# Altium project SAMA7_EVK.PrjPcb (part 2 of 5)

## Sheet 02 - Power Distribution.SchDoc
size B; CompanyName: Microchip Technology Inc.; Organization: Microchip Technology; Address1: 2355 West Chandler Blvd.; Address2: Chandler, AZ  85224; Address4: USA; SheetNumber: 3; SheetTotal: 14; SheetTitle: Power Distribution; Time: Time
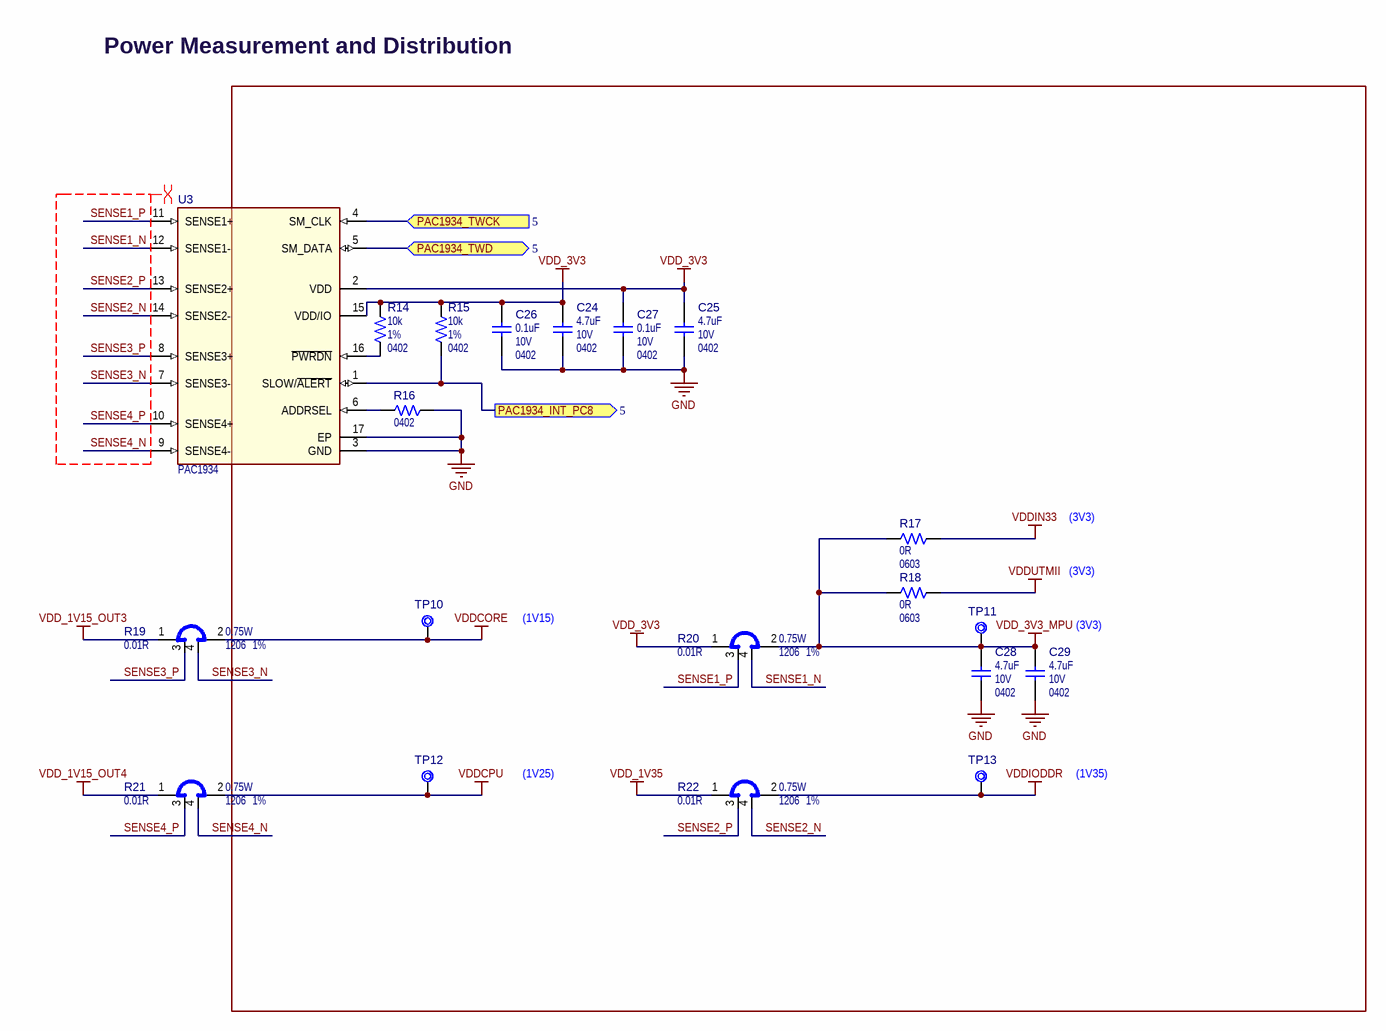
[diagram p2: 02 - Power Distribution.SchDoc]

### Parts
(Parts that share a designator on the sheet are numbered #1, #2 ... from top to bottom, then left to right.)
?#3  (no value)  (graphical)
C24  value 4.7uF  Voltage: 10V  Package: 0402  [CAP_C_0402]  (hidden comment: Capacitor NP)
C25  value 4.7uF  Voltage: 10V  Package: 0402  [CAP_C_0402]  (hidden comment: Capacitor NP)
C26  value 0.1uF  Voltage: 10V  Package: 0402  [CAP_C_0402]  (hidden comment: Capacitor NP)
C27  value 0.1uF  Voltage: 10V  Package: 0402  [CAP_C_0402]  (hidden comment: Capacitor NP)
C28  value 4.7uF  Voltage: 10V  Package: 0402  [CAP_C_0402]  (hidden comment: Capacitor NP)
C29  value 4.7uF  Voltage: 10V  Package: 0402  [CAP_C_0402]  (hidden comment: Capacitor NP)
R14  value 10k  Package: 0402  Tolerance: 1%  [RES_C_0402]  (hidden comment: Resistor)
R15  value 10k  Package: 0402  Tolerance: 1%  [RES_C_0402]  (hidden comment: Resistor)
R16  Package: 0402  [RES_C_0402]  (hidden comment: Resistor)
R17  value 0R  Package: 0603  [RES_C_0603]  (hidden comment: Resistor)
R18  value 0R  Package: 0603  [RES_C_0603]  (hidden comment: Resistor)
R19  value 0.01R  Package: 1206  Tolerance: 1%  Power: 0.75W  [RES_C_1206_SHUNT]  (hidden comment: Shunt 4 Pin)
R20  value 0.01R  Package: 1206  Tolerance: 1%  Power: 0.75W  [RES_C_1206_SHUNT]  (hidden comment: Shunt 4 Pin)
R21  value 0.01R  Package: 1206  Tolerance: 1%  Power: 0.75W  [RES_C_1206_SHUNT]  (hidden comment: Shunt 4 Pin)
R22  value 0.01R  Package: 1206  Tolerance: 1%  Power: 0.75W  [RES_C_1206_SHUNT]  (hidden comment: Shunt 4 Pin)
TP10  Test Point No BOM  [TP_1mm_SMD]  (value not drawn)  (no BOM)
TP11  Test Point No BOM  [TP_1mm_SMD]  (value not drawn)  (no BOM)
TP12  Test Point No BOM  [TP_1mm_SMD]  (value not drawn)  (no BOM)
TP13  Test Point No BOM  [TP_1mm_SMD]  (value not drawn)  (no BOM)
U3  value PAC1934  [UQFN-16_4X4_EP2.6X2.6]  (hidden comment: PAC1934 UQFN-16)

### Ports
PAC1934_INT_PC8 (out, see 5), PAC1934_TWCK (in, see 5), PAC1934_TWD (bidir, see 5)

### Nets
GND: C24.1 C25.1 C26.1 C27.1 C28.1 C29.1 R16.2 U3.3(GND) U3.17(EP)
VDD_1V15_OUT3: R19.1
VDD_1V15_OUT4: R21.1
VDD_1V35: R22.1
VDD_3V3: C24.2 C25.2 C26.2 C27.2 R14.2 R15.2 R20.1 U3.2(VDD) U3.15(VDD/IO)
VDD_3V3_MPU: C28.2 C29.2 R17.1 R18.1 R20.2 TP11.1
VDDCORE: R19.2 TP10.1
VDDCPU: R21.2 TP12.1
VDDIN33: R17.2
VDDIODDR: R22.2 TP13.1
VDDUTMII: R18.2
SENSE1_N: R20.4 U3.12(SENSE1-)
SENSE1_P: R20.3 U3.11(SENSE1+)
SENSE2_N: R22.4 U3.14(SENSE2-)
SENSE2_P: R22.3 U3.13(SENSE2+)
SENSE3_N: R19.4 U3.7(SENSE3-)
SENSE3_P: R19.3 U3.8(SENSE3+)
SENSE4_N: R21.4 U3.9(SENSE4-)
SENSE4_P: R21.3 U3.10(SENSE4+)
NetR14_1: R14.1 U3.16(~{PWRDN})
NetR15_1: R15.1 U3.1(SLOW/~{ALERT}) ; port PAC1934_INT_PC8
NetR16_1: R16.1 U3.6(ADDRSEL)
NetU3_4: U3.4(SM_CLK) ; port PAC1934_TWCK
NetU3_5: U3.5(SM_DATA) ; port PAC1934_TWD

### Layout directives
differential pair: SENSE1_N, SENSE1_P, SENSE2_N, SENSE2_P, SENSE3_N, SENSE3_P, SENSE4_N, SENSE4_P

### Notes on the sheet
- Power Measurement and Distribution
- (3V3)
- (1V15)
- (near C29) (3V3)
- (1V25)
- (1V35)
- Drawn By:
- Engineer:
- PartNumber:
- Project Title
- Sheet Title
- Size
- B
- SCH #:
- PCB #:
- Rev:
- Variant Name
- Date:
- Sheet
- Designed with
- Altium.com <http://go.altium.com/MicrochipLandingPage_Evaluation.html>
- File:

### Library data of the parts
?#3 = Title Block B
C24 C25 C28 C29 = CAP1684: Capacitor; Manufacturer 1: TDK Corporation; Manufacturer Part Number 1: C1005X5R1A475K050BC; Description_: CAP CER 4.7uF 10V 10% X5R SMD 0402; Dev Tools Status: Production; Tolerance: 10%; Temperature Coeffcient: X5R; Type: Ceramic; Owner: Jesus Aviles; Populated: YES; MCHP-ID: CAP1684; Revision: 1; Symbol: Capacitor NP; Status: MCL Design; ComponentLink1Description: SVN Datasheet; ComponentLink2Description: Local Datasheet; ComponentLink3URL: C:\ALTIUM_WORK\00001_MCHP-CDB\Library\LibraryRefs\Capacitor NP.SchLib; ComponentLink3Description: Open Symbol; ComponentLink4URL: C:\ALTIUM_WORK\00001_MCHP-CDB\Library\Footprints\CAP_C_0402.PcbLib; ComponentLink4Description: Open Footprint; ComponentLink5Description: Open Footprint 2; ComponentLink6Description: Open Footprint 3; ComponentLink7Description: Open Footprint 4; Operating Temperature: -55C to 85C; Category: Capacitor; Supplier 1: Digi-Key; Supplier Part Number 1: 445-13820-1-ND; Quantity Override: 1
C26 C27 = CAP1238: Capacitor; Manufacturer 1: KEMET; Manufacturer Part Number 1: C0402C104K8RACTU; Description_: CAP CER 0.1uF 10V 10% X7R SMD 0402; Dev Tools Status: Production; Tolerance: 10%; Temperature Coeffcient: X7R; Type: Ceramic; Owner: Tad Ahlvers; Populated: YES; MCHP-ID: CAP1238; Revision: 1; Symbol: Capacitor NP; Status: MCL Design; ComponentLink1URL: https://chn-vm-apps.microchip.com/mchprepo/parts/Datasheets/KEM_C1002_X7R_SMD.pdf; ComponentLink1Description: SVN Datasheet; ComponentLink2URL: C:\ALTIUM_WORK\00001_MCHP-CDB\Datasheets\KEM_C1002_X7R_SMD.pdf; ComponentLink2Description: Local Datasheet; ComponentLink3URL: C:\ALTIUM_WORK\00001_MCHP-CDB\Library\LibraryRefs\Capacitor NP.SchLib; ComponentLink3Description: Open Symbol; ComponentLink4URL: C:\ALTIUM_WORK\00001_MCHP-CDB\Library\Footprints\CAP_C_0402.PcbLib; ComponentLink4Description: Open Footprint; ComponentLink5Description: Open Footprint 2; ComponentLink6Description: Open Footprint 3; ComponentLink7Description: Open Footprint 4; Operating Temperature: -55C to +125C; Category: Capacitor; Manufacturer 2: Samsung; Manufacturer Part Number 2: CL05B104KP5NNNC; Manufacturer 3: Murata Electronics; Manufacturer Part Number 3: GRM155R71A104KA01D; Supplier 1: Digi-Key; Supplier Part Number 1: 399-3520-2-ND; Supplier 2: Digi-Key; Supplier Part Number 2: 1276-1002-2-ND; Supplier 3: Mouser; Supplier Part Number 3: 81-GRM155R71A104KA1D; Quantity Override: 1
R14 R15 = RSMT1019: Manufacturer 1: Panasonic; Manufacturer Part Number 1: ERJ-2RKF1002X; Description_: RES TKF 10k 1% 1/10W SMD 0402; Dev Tools Status: Production; Voltage: 50V; Temperature Coeffcient: 100ppm/C; Power: 1/10W; Owner: Brent Lanphear; Populated: Yes; MCHP-ID: RSMT1019; Revision: 2; Symbol: Resistor; Status: MCL Design; ComponentLink1URL: https://chn-vm-apps.microchip.com/mchprepo/parts/Datasheets/AOA0000CE2.pdf; ComponentLink1Description: SVN Datasheet; ComponentLink2URL: C:\ALTIUM_WORK\00001_MCHP-CDB\Datasheets\AOA0000CE2.pdf; ComponentLink2Description: Local Datasheet; ComponentLink3URL: C:\ALTIUM_WORK\00001_MCHP-CDB\Library\LibraryRefs\Resistor.SchLib; ComponentLink3Description: Open Symbol; ComponentLink4URL: C:\ALTIUM_WORK\00001_MCHP-CDB\Library\Footprints\RES_C_0402.PcbLib; ComponentLink4Description: Open Footprint; ComponentLink5Description: Open Footprint 2; ComponentLink6Description: Open Footprint 3; ComponentLink7Description: Open Footprint 4; Operating Temperature: -55C to +155C; Category: Resistor; Type: RES SMD; Composition: TKF; Supplier 1: Digi-Key; Supplier Part Number 1: P10.0KLCT-ND; Quantity Override: 1
R16 = RES2693: Manufacturer 1: Bourns Inc.; Manufacturer Part Number 1: CR0402-J/-000GLF; Description_: RES TKF 0R 1/16W SMD 0402; Dev Tools Status: Design; Power: 1/16W; Populated: YES; Owner: Dragos Danaila; Voltage: 50V; Temperature Coeffcient: 100ppm/C; Current: 1A; MCHP-ID: RES2693; Revision: 1; Symbol: Resistor; Status: MCL Design; ComponentLink1URL: https://chn-vm-apps.microchip.com/mchprepo/parts/Datasheets/crxxxxx.pdf; ComponentLink1Description: SVN Datasheet; ComponentLink2URL: C:\ALTIUM_WORK\00001_MCHP-CDB\Datasheets\crxxxxx.pdf; ComponentLink2Description: Local Datasheet; ComponentLink3URL: C:\ALTIUM_WORK\00001_MCHP-CDB\Library\LibraryRefs\Resistor.SchLib; ComponentLink3Description: Open Symbol; ComponentLink4URL: C:\ALTIUM_WORK\00001_MCHP-CDB\Library\Footprints\RES_C_0402.PcbLib; ComponentLink4Description: Open Footprint; ComponentLink5Description: Open Footprint 2; ComponentLink6Description: Open Footprint 3; ComponentLink7Description: Open Footprint 4; Operating Temperature: -55C to +155C; Category: Resistor; Type: RES SMD; Composition: TKF; Supplier 1: Digikey; Supplier Part Number 1: CR0402-J/-000GLFTR-ND; Quantity Override: 1
R17 R18 = RSMT0001: Manufacturer 1: Panasonic; Manufacturer Part Number 1: ERJ-3GSY0R00V; Description_: RES TKF 0R 1/10W SMD 0603; Dev Tools Status: Production; Power: 1/10W; Populated: YES; MCHP-ID: RSMT0001; Revision: 2; Symbol: Resistor; Status: MCL Design; ComponentLink1URL: https://chn-vm-apps.microchip.com/mchprepo/parts/Datasheets/nrc.pdf; ComponentLink1Description: SVN Datasheet; ComponentLink2URL: C:\ALTIUM_WORK\00001_MCHP-CDB\Datasheets\nrc.pdf; ComponentLink2Description: Local Datasheet; ComponentLink3URL: C:\ALTIUM_WORK\00001_MCHP-CDB\Library\LibraryRefs\Resistor.SchLib; ComponentLink3Description: Open Symbol; ComponentLink4URL: C:\ALTIUM_WORK\00001_MCHP-CDB\Library\Footprints\RES_C_0603.PcbLib; ComponentLink4Description: Open Footprint; ComponentLink5Description: Open Footprint 2; ComponentLink6Description: Open Footprint 3; ComponentLink7Description: Open Footprint 4; Operating Temperature: -55C to +155C; Category: Resistor; Type: RES SMD; Composition: TKF; Manufacturer 2: Panasonic; Manufacturer Part Number 2: ERJ-3GEY0R00V; Manufacturer 3: ROHM; Manufacturer Part Number 3: MCR03EZPJ000; Manufacturer 4: Stackpole Electronics Inc; Manufacturer Part Number 4: RMCF0603ZT0R00; Manufacturer 5: Stackpole Electronics Inc; Manufacturer Part Number 5: RMCF 1/16 0 R; Manufacturer 6: Vishay; Manufacturer Part Number 6: CRCW06030000Z0EA; Manufacturer 7: Yageo; Manufacturer Part Number 7: RC0603JR-070RL; Manufacturer 8: KOA Speer; Manufacturer Part Number 8: RK73Z1JTTP; Manufacturer 9: NIC Components; Manufacturer Part Number 9: NRC06Z0TRF; Supplier 1: Digi-Key; Supplier Part Number 1: P0.0GTR-ND; Supplier 2: Digi-Key; Supplier Part Number 2: RHM0.0GCT-ND; Supplier 3: Digi-Key; Supplier Part Number 3: RMCF0603ZT0R00TR-ND; Supplier 4: Digi-Key; Supplier Part Number 4: RMCF0603ZT0R00CT-ND; Supplier 5: Digi-Key; Supplier Part Number 5: RMCF1/160RTR-ND; Supplier 6: Digi-Key; Supplier Part Number 6: 541-0.0GCT-ND; Supplier 7: Digi-Key; Supplier Part Number 7: 311-0.0GRCT-ND; Supplier 8: KOA Speer; Supplier Part Number 8: RK73Z1JTTP; Supplier 9: NIC Components; Supplier Part Number 9: NRC06Z0TRF; Quantity Override: 1
R19-R22 = RSMT1316: Shunt; Manufacturer 1: SUSUMU; Manufacturer Part Number 1: KRL1632E-M-R010-F-T5; Description_: RES SHUNT MF 0.01R 1% 0.75W SMD 1206; Dev Tools Status: Design; Temperature Coeffcient: 50ppm/C; Current: 8A; Owner: Ciprian Abramov; Populated: YES; MCHP-ID: RSMT1316; Revision: 1; Symbol: Shunt 4 Pin; Status: MCL Design; ComponentLink1URL: https://chn-vm-apps.microchip.com/mchprepo/parts/Datasheets/n_catalog_partition09_en.pdf; ComponentLink1Description: SVN Datasheet; ComponentLink2URL: C:\ALTIUM_WORK\00001_MCHP-CDB\Datasheets\n_catalog_partition09_en.pdf; ComponentLink2Description: Local Datasheet; ComponentLink3URL: C:\ALTIUM_WORK\00001_MCHP-CDB\Library\LibraryRefs\Shunt 4 Pin.SchLib; ComponentLink3Description: Open Symbol; ComponentLink4URL: C:\ALTIUM_WORK\00001_MCHP-CDB\Library\Footprints\RES_C_1206_SHUNT.PcbLib; ComponentLink4Description: Open Footprint; ComponentLink5Description: Open Footprint 2; ComponentLink6Description: Open Footprint 3; ComponentLink7Description: Open Footprint 4; Operating Temperature: -55C to +155C; Category: Resistor; Type: RES SMD; Composition: MF; Supplier 1: Digi-Key; Supplier Part Number 1: 408-1570-1-ND; Quantity Override: 1
TP10-TP13 = CON1759: Test Point; Value: TP PAD PCB 1mm; Description_: CON TP PAD PCB 1mm SMD; Dev Tools Status: Design; Owner: Cristian Papuc; Populated: YES; MCHP-ID: CON1759; Revision: A; Symbol: Test Point No BOM; Status: MCL Design; ComponentLink1Description: SVN Datasheet; ComponentLink2Description: Local Datasheet; ComponentLink3URL: C:\ALTIUM_WORK\00001_MCHP-CDB\Library\LibraryRefs\Test Point No BOM.SchLib; ComponentLink3Description: Open Symbol; ComponentLink4URL: C:\ALTIUM_WORK\00001_MCHP-CDB\Library\Footprints\TP_1mm_SMD.PcbLib; ComponentLink4Description: Open Footprint; ComponentLink5Description: Open Footprint 2; ComponentLink6Description: Open Footprint 3; ComponentLink7Description: Open Footprint 4; Type: Test Point; Category: Connector; Quantity Override: 1
U3 = MIC8883: Manufacturer 1: Microchip Technology; Manufacturer Part Number 1: PAC1934T-I/JQ; Description_: MCHP ANALOG POWER CURRENT SENSE MONITOR PAC1934T-I/JQ UQFN-16; Dev Tools Status: Design; Owner: Ciprian Abramov; Populated: YES; MCHP-ID: MIC8883; Symbol: PAC1934 UQFN-16; Type: Power/Current Sensor; Status: MCL Design; Revision: 1; Category: MCHP-Analog; ComponentLink1Description: SVN Datasheet; ComponentLink2Description: Local Datasheet; ComponentLink3URL: C:\ALTIUM_WORK\00001_MCHP-CDB\Library\LibraryRefs\PAC1934 UQFN-16.SchLib; ComponentLink3Description: Open Symbol; ComponentLink4URL: C:\ALTIUM_WORK\00001_MCHP-CDB\Library\Footprints\UQFN-16_4X4_EP2.6X2.6.PcbLib; ComponentLink4Description: Open Footprint; ComponentLink5Description: Open Footprint 2; ComponentLink6Description: Open Footprint 3; ComponentLink7Description: Open Footprint 4; Supplier 1: Digi-Key; Supplier Part Number 1: PAC1934T-I/JQCT-ND; Quantity Override: 1

## Sheet 03 - SAMA7G54-MPU.SchDoc
size B; CompanyName: Microchip Technology Inc.; Organization: Microchip Technology; Address1: 2355 West Chandler Blvd.; Address2: Chandler, AZ  85224; Address4: USA; SheetNumber: 4; SheetTotal: 15; SheetTitle: SAMA7G5-MPU; Time: Time
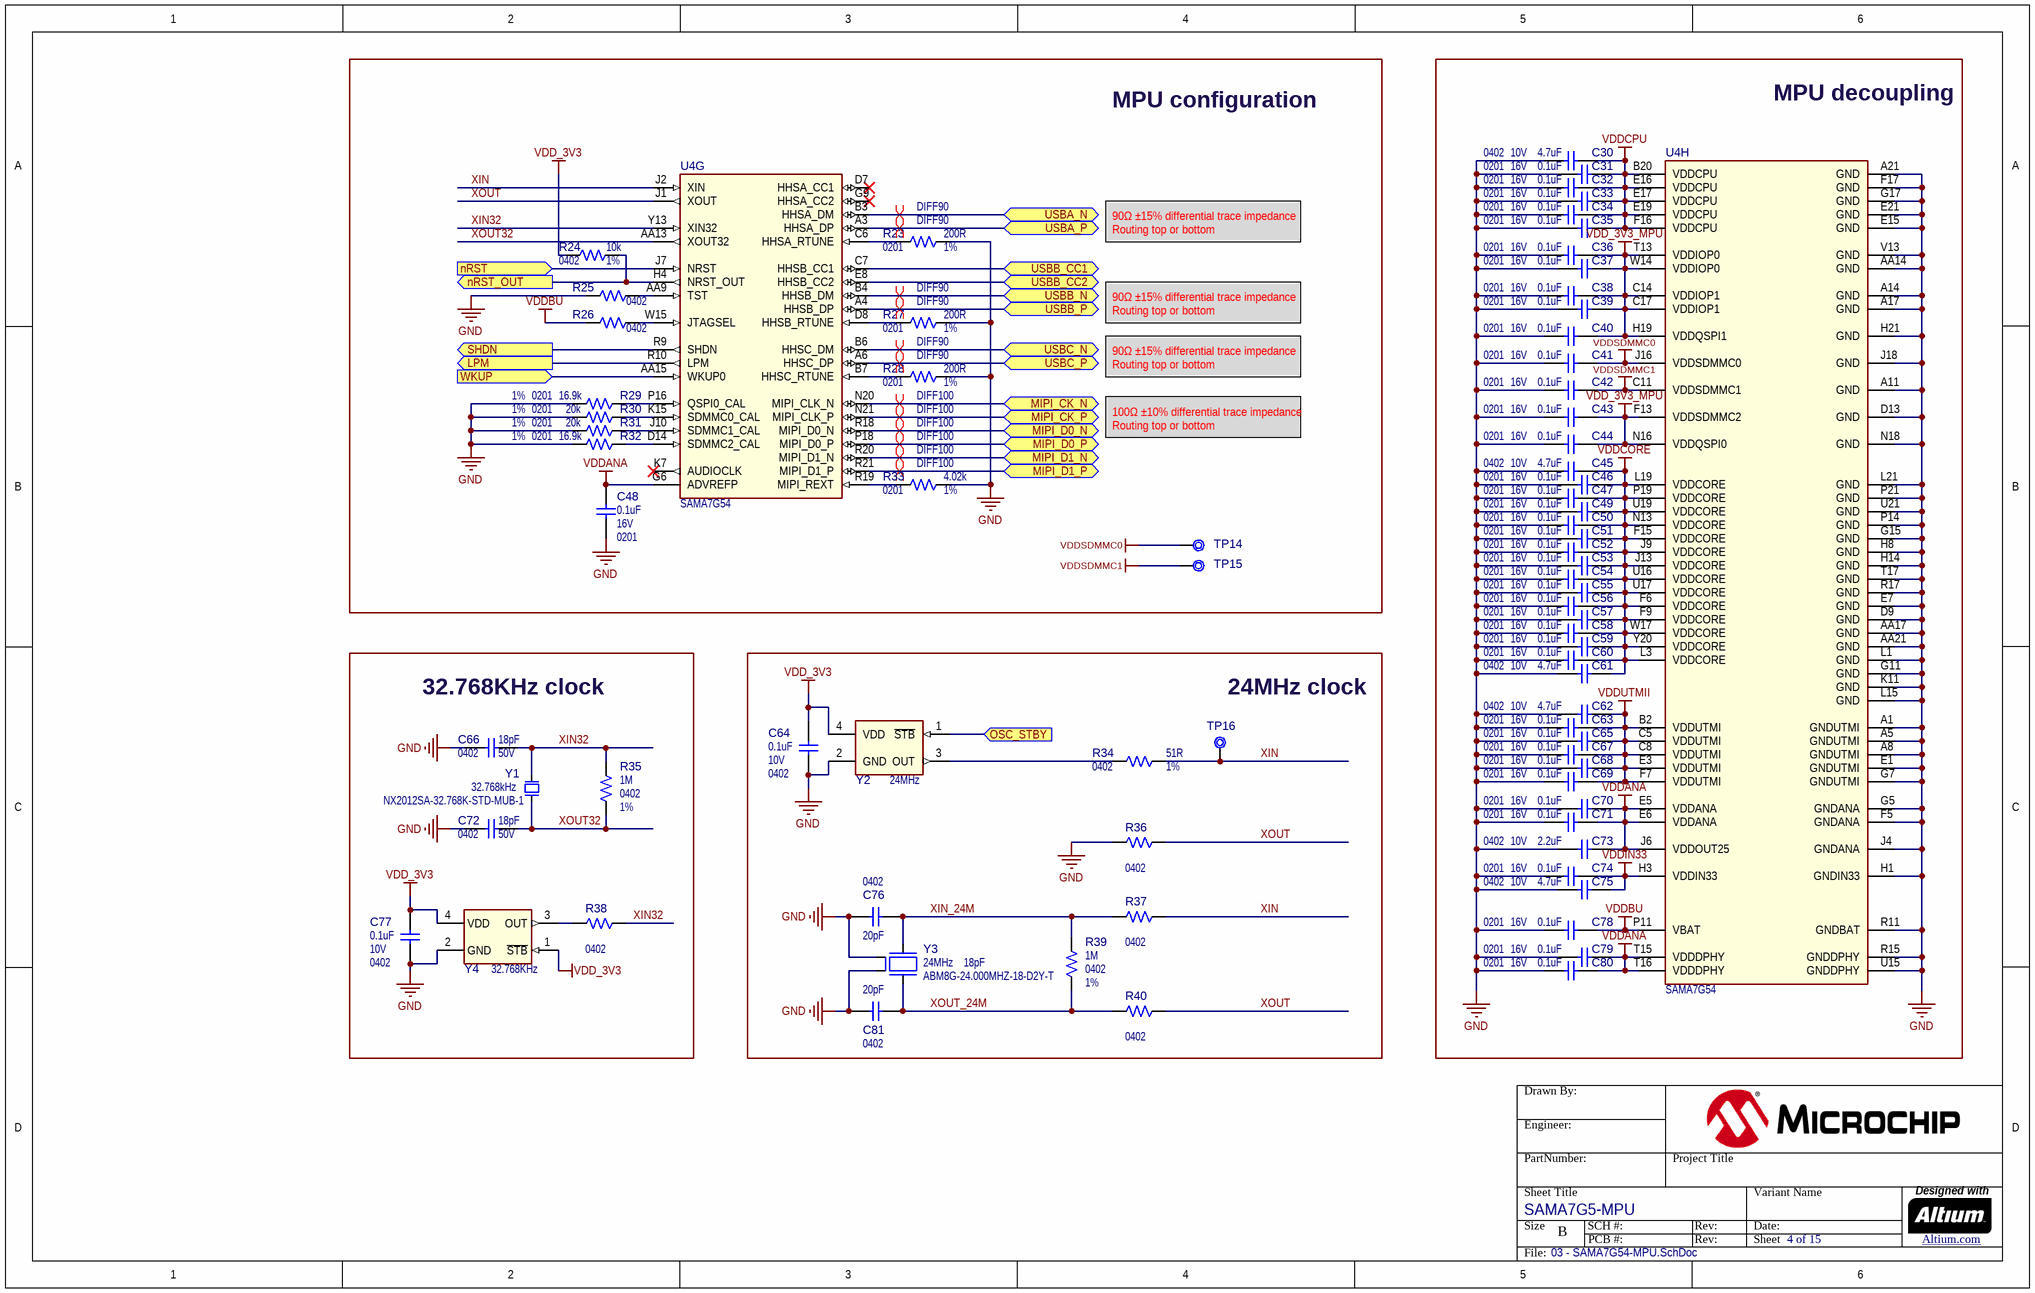
[diagram p3: 03 - SAMA7G54-MPU.SchDoc]

### Parts
(Parts that share a designator on the sheet are numbered #1, #2 ... from top to bottom, then left to right.)
?#4  (no value)  (graphical)
C30  value 4.7uF  Voltage: 10V  Package: 0402  [CAP_C_0402]  (hidden comment: Capacitor NP)
C31  value 0.1uF  Voltage: 16V  Package: 0201  [CAP_C_0201]  (hidden comment: Capacitor NP)
C32  value 0.1uF  Voltage: 16V  Package: 0201  [CAP_C_0201]  (hidden comment: Capacitor NP)
C33  value 0.1uF  Voltage: 16V  Package: 0201  [CAP_C_0201]  (hidden comment: Capacitor NP)
C34  value 0.1uF  Voltage: 16V  Package: 0201  [CAP_C_0201]  (hidden comment: Capacitor NP)
C35  value 0.1uF  Voltage: 16V  Package: 0201  [CAP_C_0201]  (hidden comment: Capacitor NP)
C36  value 0.1uF  Voltage: 16V  Package: 0201  [CAP_C_0201]  (hidden comment: Capacitor NP)
C37  value 0.1uF  Voltage: 16V  Package: 0201  [CAP_C_0201]  (hidden comment: Capacitor NP)
C38  value 0.1uF  Voltage: 16V  Package: 0201  [CAP_C_0201]  (hidden comment: Capacitor NP)
C39  value 0.1uF  Voltage: 16V  Package: 0201  [CAP_C_0201]  (hidden comment: Capacitor NP)
C40  value 0.1uF  Voltage: 16V  Package: 0201  [CAP_C_0201]  (hidden comment: Capacitor NP)
C41  value 0.1uF  Voltage: 16V  Package: 0201  [CAP_C_0201]  (hidden comment: Capacitor NP)
C42  value 0.1uF  Voltage: 16V  Package: 0201  [CAP_C_0201]  (hidden comment: Capacitor NP)
C43  value 0.1uF  Voltage: 16V  Package: 0201  [CAP_C_0201]  (hidden comment: Capacitor NP)
C44  value 0.1uF  Voltage: 16V  Package: 0201  [CAP_C_0201]  (hidden comment: Capacitor NP)
C45  value 4.7uF  Voltage: 10V  Package: 0402  [CAP_C_0402]  (hidden comment: Capacitor NP)
C46  value 0.1uF  Voltage: 16V  Package: 0201  [CAP_C_0201]  (hidden comment: Capacitor NP)
C47  value 0.1uF  Voltage: 16V  Package: 0201  [CAP_C_0201]  (hidden comment: Capacitor NP)
C48  value 0.1uF  Voltage: 16V  Package: 0201  [CAP_C_0201]  (hidden comment: Capacitor NP)
C49  value 0.1uF  Voltage: 16V  Package: 0201  [CAP_C_0201]  (hidden comment: Capacitor NP)
C50  value 0.1uF  Voltage: 16V  Package: 0201  [CAP_C_0201]  (hidden comment: Capacitor NP)
C51  value 0.1uF  Voltage: 16V  Package: 0201  [CAP_C_0201]  (hidden comment: Capacitor NP)
C52  value 0.1uF  Voltage: 16V  Package: 0201  [CAP_C_0201]  (hidden comment: Capacitor NP)
C53  value 0.1uF  Voltage: 16V  Package: 0201  [CAP_C_0201]  (hidden comment: Capacitor NP)
C54  value 0.1uF  Voltage: 16V  Package: 0201  [CAP_C_0201]  (hidden comment: Capacitor NP)
C55  value 0.1uF  Voltage: 16V  Package: 0201  [CAP_C_0201]  (hidden comment: Capacitor NP)
C56  value 0.1uF  Voltage: 16V  Package: 0201  [CAP_C_0201]  (hidden comment: Capacitor NP)
C57  value 0.1uF  Voltage: 16V  Package: 0201  [CAP_C_0201]  (hidden comment: Capacitor NP)
C58  value 0.1uF  Voltage: 16V  Package: 0201  [CAP_C_0201]  (hidden comment: Capacitor NP)
C59  value 0.1uF  Voltage: 16V  Package: 0201  [CAP_C_0201]  (hidden comment: Capacitor NP)
C60  value 0.1uF  Voltage: 16V  Package: 0201  [CAP_C_0201]  (hidden comment: Capacitor NP)
C61  value 4.7uF  Voltage: 10V  Package: 0402  [CAP_C_0402]  (hidden comment: Capacitor NP)
C62  value 4.7uF  Voltage: 10V  Package: 0402  [CAP_C_0402]  (hidden comment: Capacitor NP)
C63  value 0.1uF  Voltage: 16V  Package: 0201  [CAP_C_0201]  (hidden comment: Capacitor NP)
C64  value 0.1uF  Voltage: 10V  Package: 0402  [CAP_C_0402]  (hidden comment: Capacitor NP)
C65  value 0.1uF  Voltage: 16V  Package: 0201  [CAP_C_0201]  (hidden comment: Capacitor NP)
C66  value 18pF  Voltage: 50V  Package: 0402  [CAP_C_0402]  (hidden comment: Capacitor NP)
C67  value 0.1uF  Voltage: 16V  Package: 0201  [CAP_C_0201]  (hidden comment: Capacitor NP)
C68  value 0.1uF  Voltage: 16V  Package: 0201  [CAP_C_0201]  (hidden comment: Capacitor NP)
C69  value 0.1uF  Voltage: 16V  Package: 0201  [CAP_C_0201]  (hidden comment: Capacitor NP)
C70  value 0.1uF  Voltage: 16V  Package: 0201  [CAP_C_0201]  (hidden comment: Capacitor NP)
C71  value 0.1uF  Voltage: 16V  Package: 0201  [CAP_C_0201]  (hidden comment: Capacitor NP)
C72  value 18pF  Voltage: 50V  Package: 0402  [CAP_C_0402]  (hidden comment: Capacitor NP)
C73  value 2.2uF  Voltage: 10V  Package: 0402  [CAP_C_0402]  (hidden comment: Capacitor NP)
C74  value 0.1uF  Voltage: 16V  Package: 0201  [CAP_C_0201]  (hidden comment: Capacitor NP)
C75  value 4.7uF  Voltage: 10V  Package: 0402  [CAP_C_0402]  (hidden comment: Capacitor NP)
C76  value 20pF  Package: 0402  [CAP_C_0402]  (hidden comment: Capacitor NP)
C77  value 0.1uF  Voltage: 10V  Package: 0402  [CAP_C_0402]  (hidden comment: Capacitor NP)
C78  value 0.1uF  Voltage: 16V  Package: 0201  [CAP_C_0201]  (hidden comment: Capacitor NP)
C79  value 0.1uF  Voltage: 16V  Package: 0201  [CAP_C_0201]  (hidden comment: Capacitor NP)
C80  value 0.1uF  Voltage: 16V  Package: 0201  [CAP_C_0201]  (hidden comment: Capacitor NP)
C81  value 20pF  Package: 0402  [CAP_C_0402]  (hidden comment: Capacitor NP)
R23  value 200R  Package: 0201  Tolerance: 1%  [RES_C_0201]  (hidden comment: Resistor)
R24  value 10k  Package: 0402  Tolerance: 1%  [RES_C_0402]  (hidden comment: Resistor)
R25  Package: 0402  [RES_C_0402]  (hidden comment: Resistor)
R26  Package: 0402  [RES_C_0402]  (hidden comment: Resistor)
R27  value 200R  Package: 0201  Tolerance: 1%  [RES_C_0201]  (hidden comment: Resistor)
R28  value 200R  Package: 0201  Tolerance: 1%  [RES_C_0201]  (hidden comment: Resistor)
R29  value 16.9k  Package: 0201  Tolerance: 1%  [RES_C_0201]  (hidden comment: Resistor)
R30  value 20k  Package: 0201  Tolerance: 1%  [RES_C_0201]  (hidden comment: Resistor)
R31  value 20k  Package: 0201  Tolerance: 1%  [RES_C_0201]  (hidden comment: Resistor)
R32  value 16.9k  Package: 0201  Tolerance: 1%  [RES_C_0201]  (hidden comment: Resistor)
R33  value 4.02k  Package: 0201  Tolerance: 1%  [RES_C_0201]  (hidden comment: Resistor)
R34  value 51R  Package: 0402  Tolerance: 1%  [RES_C_0402]  (hidden comment: Resistor)
R35  value 1M  Package: 0402  Tolerance: 1%  [RES_C_0402]  (hidden comment: Resistor)
R36  Package: 0402  [RES_C_0402]  (hidden comment: Resistor)
R37  Package: 0402  [RES_C_0402]  (hidden comment: Resistor)
R38  Package: 0402  [RES_C_0402]  (hidden comment: Resistor)
R39  value 1M  Package: 0402  Tolerance: 1%  [RES_C_0402]  (hidden comment: Resistor)
R40  Package: 0402  [RES_C_0402]  (hidden comment: Resistor)
TP14  Test Point No BOM  [TP_1mm_SMD]  (value not drawn)  (no BOM)
TP15  Test Point No BOM  [TP_1mm_SMD]  (value not drawn)  (no BOM)
TP16  Test Point No BOM  [TP_1mm_SMD]  (value not drawn)  (no BOM)
U4  SAMA7G54  [TFBGA-343_14x14]  (parts G,H of 8)
Y1  value 32.768kHz  Manufacturer Part Number 1: NX2012SA-32.768K-STD-MUB-1  [CRYSTAL_NX2012SA]  (hidden comment: Crystal 2 Pins)
Y2  value 24MHz  [DFN-4_2.5x2]  (hidden comment: DSC10xx DFN-4)
Y3  value 24MHz  Load Capacitance: 18pF  Manufacturer Part Number 1: ABM8G-24.000MHZ-18-D2Y-T  [CRYSTAL_ABM8G]  (hidden comment: Crystal 4 Pins)
Y4  value 32.768KHz  [DFN-4_2x1.6]  (hidden comment: DSC60xx DFN-4_LGA-4)

### Blocks framed on the sheet
MPU configuration: C48 R23-R33 TP14 TP15 U4
MPU decoupling: C30-C47 C49-C63 C65 C67-C71 C73-C75 C78-C80 U4
32.768KHz clock: C66 C72 C77 R35 R38 Y1 Y4
24MHz clock: C64 C76 C81 R34 R36 R37 R39 R40 TP16 Y2 Y3

### Ports
LPM (out), MIPI_CK_N (bidir), MIPI_CK_P (bidir), MIPI_D0_N (bidir), MIPI_D0_P (bidir), MIPI_D1_N (bidir), MIPI_D1_P (bidir), nRST (in), nRST_OUT (out), OSC_STBY (in), SHDN (out), USBA_N (bidir), USBA_P (bidir), USBB_CC1 (bidir), USBB_CC2 (bidir), USBB_N (bidir), USBB_P (bidir), USBC_N (bidir), USBC_P (bidir), WKUP (in)

### Nets
GND: C30.2 C31.2 C32.2 C33.2 C34.2 C35.2 C36.2 C37.2 C38.2 C39.2 C40.2 C41.2 C42.2 C43.2 C44.2 C45.2 C46.2 C47.2 C48.1 C49.2 C50.2 C51.2 C52.2 C53.2 C54.2 C55.2 C56.2 C57.2 C58.2 C59.2 C60.2 C61.2 C62.2 C63.2 C64.1 C65.2 C66.1 C67.2 C68.2 C69.2 C70.2 C71.2 C72.1 C73.2 C74.2 C75.2 C76.1 C77.1 C78.2 C79.2 C80.2 C81.1 R23.2 R25.1 R27.2 R28.2 R29.1 R30.1 R31.1 R32.1 R33.2 R36.1 U4.A1(GNDUTMI) U4.A5(GNDUTMI) U4.A8(GNDUTMI) U4.A11(GND) U4.A14(GND) U4.A17(GND) U4.A21(GND) U4.AA14(GND) U4.AA17(GND) U4.AA21(GND) U4.D9(GND) U4.D13(GND) U4.E1(GNDUTMI) U4.E7(GND) U4.E15(GND) U4.E21(GND) U4.F5(GNDANA) U4.F17(GND) U4.G5(GNDANA) U4.G7(GNDUTMI) U4.G11(GND) U4.G15(GND) U4.G17(GND) U4.H1(GNDIN33) U4.H8(GND) U4.H14(GND) U4.H21(GND) U4.J4(GNDANA) U4.J18(GND) U4.K11(GND) U4.L1(GND) U4.L15(GND) U4.L21(GND) U4.N18(GND) U4.P14(GND) U4.P21(GND) U4.R11(GNDBAT) U4.R15(GNDDPHY) U4.R17(GND) U4.T17(GND) U4.U15(GNDDPHY) U4.U21(GND) U4.V13(GND) Y2.2(GND) Y3.2(GND) Y3.4(GND) Y4.2(GND)
VDD_3V3: C64.2 C77.2 R24.2 Y2.4(VDD) Y4.1(~{STB}) Y4.4(VDD)
VDD_3V3_MPU: C36.1 C37.1 C38.1 C39.1 C40.1 C43.1 C44.1 U4.C14(VDDIOP1) U4.C17(VDDIOP1) U4.F13(VDDSDMMC2) U4.H19(VDDQSPI1) U4.N16(VDDQSPI0) U4.T13(VDDIOP0) U4.W14(VDDIOP0)
VDDANA: C48.2 C70.1 C71.1 C73.1 C79.1 C80.1 U4.E5(VDDANA) U4.E6(VDDANA) U4.G6(ADVREFP) U4.J6(VDDOUT25) U4.T15(VDDDPHY) U4.T16(VDDDPHY)
VDDBU: C78.1 R26.1 U4.P11(VBAT)
VDDCORE: C45.1 C46.1 C47.1 C49.1 C50.1 C51.1 C52.1 C53.1 C54.1 C55.1 C56.1 C57.1 C58.1 C59.1 C60.1 C61.1 U4.F6(VDDCORE) U4.F9(VDDCORE) U4.F15(VDDCORE) U4.J9(VDDCORE) U4.J13(VDDCORE) U4.L3(VDDCORE) U4.L19(VDDCORE) U4.N13(VDDCORE) U4.P19(VDDCORE) U4.U16(VDDCORE) U4.U17(VDDCORE) U4.U19(VDDCORE) U4.W17(VDDCORE) U4.Y20(VDDCORE)
VDDCPU: C30.1 C31.1 C32.1 C33.1 C34.1 C35.1 U4.B20(VDDCPU) U4.E16(VDDCPU) U4.E17(VDDCPU) U4.E19(VDDCPU) U4.F16(VDDCPU)
VDDIN33: C74.1 C75.1 U4.H3(VDDIN33)
VDDSDMMC0: C41.1 TP14.1 U4.J16(VDDSDMMC0)
VDDSDMMC1: C42.1 TP15.1 U4.C11(VDDSDMMC1)
VDDUTMII: C62.1 C63.1 C65.1 C67.1 C68.1 C69.1 U4.B2(VDDUTMI) U4.C5(VDDUTMI) U4.C8(VDDUTMI) U4.E3(VDDUTMI) U4.F7(VDDUTMI)
XIN: R34.2 R37.2 TP16.1 U4.J2(XIN)
XIN32: C66.2 R35.2 R38.2 U4.Y13(XIN32) Y1.2(Osc2)
XIN_24M: C76.2 R37.1 R39.2 Y3.3(Osc2)
XOUT: R36.2 R40.2 U4.J1(XOUT)
XOUT32: C72.2 R35.1 U4.AA13(XOUT32) Y1.1(Osc1)
XOUT_24M: C81.2 R39.1 R40.1 Y3.1(Osc1)
NetJ11_2: U4.R18(MIPI_D0_N) ; port MIPI_D0_N
NetJ11_3: U4.P18(MIPI_D0_P) ; port MIPI_D0_P
NetJ11_5: U4.R20(MIPI_D1_N) ; port MIPI_D1_N
NetJ11_6: U4.R21(MIPI_D1_P) ; port MIPI_D1_P
NetJ11_8: U4.N20(MIPI_CLK_N) ; port MIPI_CK_N
NetJ11_9: U4.N21(MIPI_CLK_P) ; port MIPI_CK_P
NetQ3_1: U4.R10(LPM) ; port LPM
NetQ3_3: Y2.1(~{STB}) ; port OSC_STBY
NetR3_2: U4.R9(SHDN) ; port SHDN
NetR4_1: U4.J7(NRST) ; port nRST
NetR6_1: U4.AA15(WKUP0) ; port WKUP
NetR23_1: R23.1 U4.C6(HHSA_RTUNE)
NetR24_1: R24.1 U4.H4(NRST_OUT) ; port nRST_OUT
NetR25_2: R25.2 U4.AA9(TST)
NetR26_2: R26.2 U4.W15(JTAGSEL)
NetR27_1: R27.1 U4.D8(HHSB_RTUNE)
NetR28_1: R28.1 U4.B7(HHSC_RTUNE)
NetR29_2: R29.2 U4.P16(QSPI0_CAL)
NetR30_2: R30.2 U4.K15(SDMMC0_CAL)
NetR31_2: R31.2 U4.J10(SDMMC1_CAL)
NetR32_2: R32.2 U4.D14(SDMMC2_CAL)
NetR33_1: R33.1 U4.R19(MIPI_REXT)
NetR34_1: R34.1 Y2.3(OUT)
NetR38_1: R38.1 Y4.3(OUT)
NetU4_A3: U4.A3(HHSA_DP) ; port USBA_P
NetU4_A4: U4.A4(HHSB_DP) ; port USBB_P
NetU4_A6: U4.A6(HHSC_DP) ; port USBC_P
NetU4_B3: U4.B3(HHSA_DM) ; port USBA_N
NetU4_B4: U4.B4(HHSB_DM) ; port USBB_N
NetU4_B6: U4.B6(HHSC_DM) ; port USBC_N
NetU4_C7: U4.C7(HHSB_CC1) ; port USBB_CC1
NetU4_E8: U4.E8(HHSB_CC2) ; port USBB_CC2

Not connected (* = marked no-connect by the designer): U4 D7(HHSA_CC1)* G9(HHSA_CC2)* K7(AUDIOCLK)*

### Layout directives
differential pair; differential pair class DIFF100; net class DIFF100; rule Matched Net Lengths [Tolerance = 4mil]: NetJ11_2, NetJ11_3, NetJ11_5, NetJ11_6, NetJ11_8, NetJ11_9
differential pair; differential pair class DIFF90; net class DIFF90; rule Matched Net Lengths [Tolerance = 0.1mm]: NetU4_A3, NetU4_A4, NetU4_A6, NetU4_B3, NetU4_B4, NetU4_B6

### Notes on the sheet
- 90Ω ±15% differential trace impedance
  Routing top or bottom
- 100Ω ±10% differential trace impedance
  Routing top or bottom
- Drawn By:
- Engineer:
- PartNumber:
- Project Title
- Sheet Title
- Size
- B
- SCH #:
- PCB #:
- Rev:
- Variant Name
- Date:
- Sheet
- Designed with
- Altium.com <http://go.altium.com/MicrochipLandingPage_Evaluation.html>
- File:

### Library data of the parts
?#4 = Title Block B
C30 C45 C61 C62 C75 = CAP1684: as C24 on sheet 02 - Power Distribution; MCHP-ID: CAP1684; Revision: 1; Symbol: Capacitor NP; Status: MCL Design; ComponentLink1Description: SVN Datasheet; ComponentLink2Description: Local Datasheet; ComponentLink3URL: C:\ALTIUM_WORK\00001_MCHP-CDB\Library\LibraryRefs\Capacitor NP.SchLib; ComponentLink3Description: Open Symbol; ComponentLink4URL: C:\ALTIUM_WORK\00001_MCHP-CDB\Library\Footprints\CAP_C_0402.PcbLib; ComponentLink4Description: Open Footprint; ComponentLink5Description: Open Footprint 2; ComponentLink6Description: Open Footprint 3; ComponentLink7Description: Open Footprint 4; Operating Temperature: -55C to 85C; Category: Capacitor; Supplier 1: Digi-Key; Supplier Part Number 1: 445-13820-1-ND; Quantity Override: 1
C31-C44 C46-C60 C63 C65 C67-C71 C74 C78-C80 = CAP1978: Capacitor; Manufacturer 1: Murata Electronics North America; Manufacturer Part Number 1: GRM033C71C104KE14D; Description_: CAP CER 0.1uF 16V 10% X7S 0201; Dev Tools Status: Design; Tolerance: 10%; Temperature Coeffcient: X7S; Owner: Dragos Danaila; Populated: YES; MCHP-ID: CAP1978; Symbol: Capacitor NP; Status: MCL Design; ComponentLink1URL: https://chn-vm-apps.microchip.com/mchprepo/parts/Datasheets/GRM033C71C104KE14-01.pdf; ComponentLink1Description: SVN Datasheet; ComponentLink2URL: C:\ALTIUM_WORK\00001_MCHP-CDB\Datasheets\GRM033C71C104KE14-01.pdf; ComponentLink2Description: Local Datasheet; ComponentLink3URL: C:\ALTIUM_WORK\00001_MCHP-CDB\Library\LibraryRefs\Capacitor NP.SchLib; ComponentLink3Description: Open Symbol; ComponentLink4URL: C:\ALTIUM_WORK\00001_MCHP-CDB\Library\Footprints\CAP_C_0201.PcbLib; ComponentLink4Description: Open Footprint; ComponentLink5Description: Open Footprint 2; ComponentLink6Description: Open Footprint 3; ComponentLink7Description: Open Footprint 4; Operating Temperature: -55C to +125C; Category: Capacitor; Supplier 1: Digi-Key; Supplier Part Number 1: 490-10387-1-ND; Quantity Override: 1
  C31-C44 C46 C47 C49-C60 C63 C65 C67-C71 C74 C78-C80: Revision: F; Manufacturer 2: Murata Electronics; Manufacturer Part Number 2: GRM033C71C104KE14J; Manufacturer 3: Murata Electronics; Manufacturer Part Number 3: GRM033C71C104KE14E; Supplier 2: Mouser; Supplier Part Number 2: 81-GRM033C71C104KE4J; Supplier 3: Mouser; Supplier Part Number 3: 81-GRM033C71C104KE4E
  C48: Revision: C
C64 = CAP1238: as C26 on sheet 02 - Power Distribution; MCHP-ID: CAP1238; Revision: 1; Symbol: Capacitor NP; Status: MCL Design; ComponentLink1URL: https://chn-vm-apps.microchip.com/mchprepo/parts/Datasheets/KEM_C1002_X7R_SMD.pdf; ComponentLink1Description: SVN Datasheet; ComponentLink2URL: C:\ALTIUM_WORK\00001_MCHP-CDB\Datasheets\KEM_C1002_X7R_SMD.pdf; ComponentLink2Description: Local Datasheet; ComponentLink3URL: C:\ALTIUM_WORK\00001_MCHP-CDB\Library\LibraryRefs\Capacitor NP.SchLib; ComponentLink3Description: Open Symbol; ComponentLink4URL: C:\ALTIUM_WORK\00001_MCHP-CDB\Library\Footprints\CAP_C_0402.PcbLib; ComponentLink4Description: Open Footprint; ComponentLink5Description: Open Footprint 2; ComponentLink6Description: Open Footprint 3; ComponentLink7Description: Open Footprint 4; Operating Temperature: -55C to +125C; Category: Capacitor; Manufacturer 2: Samsung; Manufacturer Part Number 2: CL05B104KP5NNNC; Manufacturer 3: Murata Electronics; Manufacturer Part Number 3: GRM155R71A104KA01D; Supplier 1: Digi-Key; Supplier Part Number 1: 399-3520-2-ND; Supplier 2: Digi-Key; Supplier Part Number 2: 1276-1002-2-ND; Supplier 3: Mouser; Supplier Part Number 3: 81-GRM155R71A104KA1D; Quantity Override: 1
C66 C72 = CAP1091: Manufacturer 1: Murata Electronics; Manufacturer Part Number 1: GCM1555C1H180JA16D; Description_: CAP CER 18pF 50V 5% C0G SMD 0402; Dev Tools Status: Production; Tolerance: 5%; Type: Ceramic; Owner: Tad Ahlvers; Populated: YES; Temperature Coefficient: C0G; MCHP-ID: CAP1091; Revision: 2; Symbol: Capacitor NP; Status: MCL Design; ComponentLink1URL: https://chn-vm-apps.microchip.com/mchprepo/parts/Datasheets/c02e.pdf; ComponentLink1Description: SVN Datasheet; ComponentLink2URL: C:\ALTIUM_WORK\00001_MCHP-CDB\Datasheets\c02e.pdf; ComponentLink2Description: Local Datasheet; ComponentLink3URL: C:\ALTIUM_WORK\00001_MCHP-CDB\Library\LibraryRefs\Capacitor NP.SchLib; ComponentLink3Description: Open Symbol; ComponentLink4URL: C:\ALTIUM_WORK\00001_MCHP-CDB\Library\Footprints\CAP_C_0402.PcbLib; ComponentLink4Description: Open Footprint; ComponentLink5Description: Open Footprint 2; ComponentLink6Description: Open Footprint 3; ComponentLink7Description: Open Footprint 4; Operating Temperature: -55C to +125C; Category: Capacitor; Manufacturer 2: Murata; Manufacturer Part Number 2: GRM1555C1H180JA01D; Supplier 1: Digi-Key; Supplier Part Number 1: 490-12650-2-ND; Supplier 2: Digi-Key; Supplier Part Number 2: 490-5858-1-ND; Quantity Override: 1; Manufacturer 3: Murata; Manufacturer Part Number 3: GRM1555C1H180JZ01; Supplier 3: Murata; Supplier Part Number 3: GRM1555C1H180JZ01
C73 = CAP1468: Capacitor; Manufacturer 1: TDK Corporation; Manufacturer Part Number 1: C1005X7S1A225K050BC; Description_: CAP CER 2.2uF 10V 10% X7S SMD 0402; Dev Tools Status: Production; Tolerance: 10%; Temperature Coeffcient: X7S; Type: Ceramic; Owner: Sorin Stanoaia; Populated: YES; MCHP-ID: CAP1468; Revision: 1; Symbol: Capacitor NP; Status: MCL Design; ComponentLink1URL: https://chn-vm-apps.microchip.com/mchprepo/parts/Datasheets/c02e.pdf; ComponentLink1Description: SVN Datasheet; ComponentLink2URL: C:\ALTIUM_WORK\00001_MCHP-CDB\Datasheets\c02e.pdf; ComponentLink2Description: Local Datasheet; ComponentLink3URL: C:\ALTIUM_WORK\00001_MCHP-CDB\Library\LibraryRefs\Capacitor NP.SchLib; ComponentLink3Description: Open Symbol; ComponentLink4URL: C:\ALTIUM_WORK\00001_MCHP-CDB\Library\Footprints\CAP_C_0402.PcbLib; ComponentLink4Description: Open Footprint; ComponentLink5Description: Open Footprint 2; ComponentLink6Description: Open Footprint 3; ComponentLink7Description: Open Footprint 4; Operating Temperature: -55C to +125C; Category: Capacitor; Manufacturer 2: Murata Electronics North America; Manufacturer Part Number 2: GRM155C71A225KE11J; Supplier 1: Digi-Key; Supplier Part Number 1: 445-9097-1-ND; Supplier 2: Digi-Key; Supplier Part Number 2: GRM155C71A225KE11J-ND; Quantity Override: 1
C76 C81 = CAP2438: Manufacturer 1: Samsung Electro-Mechanics; Manufacturer Part Number 1: CL05C200GB51PNC; Voltage: 50V; Description_: Ceramic capacitor, SMD 0402, 20pF, C0G, 50V, +/-2%; Dev Tools Status: Design; Tolerance: 2%; Temperature Coeffcient: C0G; Type: Ceramic; Populated: DNP; Owner: Dragos Danaila; MCHP-ID: CAP2438; Revision: 1; Symbol: Capacitor NP; Status: MCL Design; ComponentLink1Description: SVN Datasheet; ComponentLink2Description: Local Datasheet; ComponentLink3URL: C:\ALTIUM_WORK\00001_MCHP-CDB\Library\LibraryRefs\Capacitor NP.SchLib; ComponentLink3Description: Open Symbol; ComponentLink4URL: C:\ALTIUM_WORK\00001_MCHP-CDB\Library\Footprints\CAP_C_0402.PcbLib; ComponentLink4Description: Open Footprint; ComponentLink5Description: Open Footprint 2; ComponentLink6Description: Open Footprint 3; ComponentLink7Description: Open Footprint 4; Operating Temperature: -55C to +125C; Category: Capacitor; Supplier 1: Digikey; Supplier Part Number 1: 1276-CL05C200GB51PNCTR-ND; Quantity Override: 1
C77 = CAP1238: Capacitor; Manufacturer 1: KEMET; Manufacturer Part Number 1: C0402C104K8RACTU; Description_: CAP CER 0.1uF 10V 10% X7R SMD 0402; Dev Tools Status: Production; Tolerance: 10%; Temperature Coeffcient: X7R; Type: Ceramic; Owner: Tad Ahlvers; Populated: DNP; MCHP-ID: CAP1238; Revision: 1; Symbol: Capacitor NP; Status: MCL Design; ComponentLink1URL: https://chn-vm-apps.microchip.com/mchprepo/parts/Datasheets/KEM_C1002_X7R_SMD.pdf; ComponentLink1Description: SVN Datasheet; ComponentLink2URL: C:\ALTIUM_WORK\00001_MCHP-CDB\Datasheets\KEM_C1002_X7R_SMD.pdf; ComponentLink2Description: Local Datasheet; ComponentLink3URL: C:\ALTIUM_WORK\00001_MCHP-CDB\Library\LibraryRefs\Capacitor NP.SchLib; ComponentLink3Description: Open Symbol; ComponentLink4URL: C:\ALTIUM_WORK\00001_MCHP-CDB\Library\Footprints\CAP_C_0402.PcbLib; ComponentLink4Description: Open Footprint; ComponentLink5Description: Open Footprint 2; ComponentLink6Description: Open Footprint 3; ComponentLink7Description: Open Footprint 4; Operating Temperature: -55C to +125C; Category: Capacitor; Manufacturer 2: Samsung; Manufacturer Part Number 2: CL05B104KP5NNNC; Manufacturer 3: Murata Electronics; Manufacturer Part Number 3: GRM155R71A104KA01D; Supplier 1: Digi-Key; Supplier Part Number 1: 399-3520-2-ND; Supplier 2: Digi-Key; Supplier Part Number 2: 1276-1002-2-ND; Supplier 3: Mouser; Supplier Part Number 3: 81-GRM155R71A104KA1D; Quantity Override: 1
R23 R27 R28 = RSMT1291: Manufacturer 1: Bourns Inc.; Manufacturer Part Number 1: CR0201-FW-2000GLF; Description_: RES TKF 200R 1% 1/20W SMD 0201; Dev Tools Status: Design; Temperature Coeffcient: 200ppm/C; Power: 1/20W; Owner: Dragos Danaila; Populated: YES; Voltage: 30V; MCHP-ID: RSMT1291; Revision: 1; Symbol: Resistor; Status: MCL Design; ComponentLink1URL: https://chn-vm-apps.microchip.com/mchprepo/parts/Datasheets/crxxxxx.pdf; ComponentLink1Description: SVN Datasheet; ComponentLink2URL: C:\ALTIUM_WORK\00001_MCHP-CDB\Datasheets\crxxxxx.pdf; ComponentLink2Description: Local Datasheet; ComponentLink3URL: C:\ALTIUM_WORK\00001_MCHP-CDB\Library\LibraryRefs\Resistor.SchLib; ComponentLink3Description: Open Symbol; ComponentLink4URL: C:\ALTIUM_WORK\00001_MCHP-CDB\Library\Footprints\RES_C_0201.PcbLib; ComponentLink4Description: Open Footprint; ComponentLink5Description: Open Footprint 2; ComponentLink6Description: Open Footprint 3; ComponentLink7Description: Open Footprint 4; Operating Temperature: -55C to +125C; Category: Resistor; Type: RES SMD; Composition: TKF; Supplier 1: Mouser; Supplier Part Number 1: 652-CR0201FW2000GLF; Quantity Override: 1
R24 = RSMT1019: Manufacturer 1: Panasonic; Manufacturer Part Number 1: ERJ-2RKF1002X; Description_: RES TKF 10k 1% 1/10W SMD 0402; Dev Tools Status: Production; Voltage: 50V; Temperature Coeffcient: 100ppm/C; Power: 1/10W; Owner: Brent Lanphear; Populated: DNP; MCHP-ID: RSMT1019; Revision: 2; Symbol: Resistor; Status: MCL Design; ComponentLink1URL: https://chn-vm-apps.microchip.com/mchprepo/parts/Datasheets/AOA0000CE2.pdf; ComponentLink1Description: SVN Datasheet; ComponentLink2URL: C:\ALTIUM_WORK\00001_MCHP-CDB\Datasheets\AOA0000CE2.pdf; ComponentLink2Description: Local Datasheet; ComponentLink3URL: C:\ALTIUM_WORK\00001_MCHP-CDB\Library\LibraryRefs\Resistor.SchLib; ComponentLink3Description: Open Symbol; ComponentLink4URL: C:\ALTIUM_WORK\00001_MCHP-CDB\Library\Footprints\RES_C_0402.PcbLib; ComponentLink4Description: Open Footprint; ComponentLink5Description: Open Footprint 2; ComponentLink6Description: Open Footprint 3; ComponentLink7Description: Open Footprint 4; Operating Temperature: -55C to +155C; Category: Resistor; Type: RES SMD; Composition: TKF; Supplier 1: Digi-Key; Supplier Part Number 1: P10.0KLCT-ND; Quantity Override: 1
R25 R36 = RES2693: as R16 on sheet 02 - Power Distribution; MCHP-ID: RES2693; Revision: 1; Symbol: Resistor; Status: MCL Design; ComponentLink1URL: https://chn-vm-apps.microchip.com/mchprepo/parts/Datasheets/crxxxxx.pdf; ComponentLink1Description: SVN Datasheet; ComponentLink2URL: C:\ALTIUM_WORK\00001_MCHP-CDB\Datasheets\crxxxxx.pdf; ComponentLink2Description: Local Datasheet; ComponentLink3URL: C:\ALTIUM_WORK\00001_MCHP-CDB\Library\LibraryRefs\Resistor.SchLib; ComponentLink3Description: Open Symbol; ComponentLink4URL: C:\ALTIUM_WORK\00001_MCHP-CDB\Library\Footprints\RES_C_0402.PcbLib; ComponentLink4Description: Open Footprint; ComponentLink5Description: Open Footprint 2; ComponentLink6Description: Open Footprint 3; ComponentLink7Description: Open Footprint 4; Operating Temperature: -55C to +155C; Category: Resistor; Type: RES SMD; Composition: TKF; Supplier 1: Digikey; Supplier Part Number 1: CR0402-J/-000GLFTR-ND; Quantity Override: 1
R26 R37 R38 R40 = RES2693: Manufacturer 1: Bourns Inc.; Manufacturer Part Number 1: CR0402-J/-000GLF; Description_: RES TKF 0R 1/16W SMD 0402; Dev Tools Status: Design; Power: 1/16W; Populated: DNP; Owner: Dragos Danaila; Voltage: 50V; Temperature Coeffcient: 100ppm/C; Current: 1A; MCHP-ID: RES2693; Revision: 1; Symbol: Resistor; Status: MCL Design; ComponentLink1URL: https://chn-vm-apps.microchip.com/mchprepo/parts/Datasheets/crxxxxx.pdf; ComponentLink1Description: SVN Datasheet; ComponentLink2URL: C:\ALTIUM_WORK\00001_MCHP-CDB\Datasheets\crxxxxx.pdf; ComponentLink2Description: Local Datasheet; ComponentLink3URL: C:\ALTIUM_WORK\00001_MCHP-CDB\Library\LibraryRefs\Resistor.SchLib; ComponentLink3Description: Open Symbol; ComponentLink4URL: C:\ALTIUM_WORK\00001_MCHP-CDB\Library\Footprints\RES_C_0402.PcbLib; ComponentLink4Description: Open Footprint; ComponentLink5Description: Open Footprint 2; ComponentLink6Description: Open Footprint 3; ComponentLink7Description: Open Footprint 4; Operating Temperature: -55C to +155C; Category: Resistor; Type: RES SMD; Composition: TKF; Supplier 1: Digikey; Supplier Part Number 1: CR0402-J/-000GLFTR-ND; Quantity Override: 1
R29 R32 = RSMT1292: Manufacturer 1: Panasonic Electronic Components; Manufacturer Part Number 1: ERJ-1GNF1692C; Description_: RES TKF 16.9k 1% 1/20W SMD 0201; Dev Tools Status: Design; Temperature Coeffcient: 200ppm/C; Power: 1/20W; Owner: Dragos Danaila; Populated: YES; Voltage: 25V; MCHP-ID: RSMT1292; Revision: 1; Symbol: Resistor; Status: MCL Design; ComponentLink1URL: https://chn-vm-apps.microchip.com/mchprepo/parts/Datasheets/AOA0000C304.pdf; ComponentLink1Description: SVN Datasheet; ComponentLink2URL: C:\ALTIUM_WORK\00001_MCHP-CDB\Datasheets\AOA0000C304.pdf; ComponentLink2Description: Local Datasheet; ComponentLink3URL: C:\ALTIUM_WORK\00001_MCHP-CDB\Library\LibraryRefs\Resistor.SchLib; ComponentLink3Description: Open Symbol; ComponentLink4URL: C:\ALTIUM_WORK\00001_MCHP-CDB\Library\Footprints\RES_C_0201.PcbLib; ComponentLink4Description: Open Footprint; ComponentLink5Description: Open Footprint 2; ComponentLink6Description: Open Footprint 3; ComponentLink7Description: Open Footprint 4; Operating Temperature: -55C to +125C; Category: Resistor; Type: RES SMD; Composition: TKF; Supplier 1: Digikey; Supplier Part Number 1: P122771TR-ND; Quantity Override: 1
R30 R31 = RSMT1354: Manufacturer 1: Vishay Dale; Manufacturer Part Number 1: CRCW020120K0FNED; Description_: RES TKF 20k 1% 1/20W SMD 0201; Dev Tools Status: Design; Power: 1/20W; Owner: Ciprian Abramov; Populated: YES; Voltage: 30V; Temperature Coefficient: 200ppm/C; MCHP-ID: RSMT1354; Revision: 1; Symbol: Resistor; Status: MCL Design; ComponentLink1URL: https://chn-vm-apps.microchip.com/mchprepo/parts/Datasheets/crcw0201e3.pdf; ComponentLink1Description: SVN Datasheet; ComponentLink2URL: C:\ALTIUM_WORK\00001_MCHP-CDB\Datasheets\crcw0201e3.pdf; ComponentLink2Description: Local Datasheet; ComponentLink3URL: C:\ALTIUM_WORK\00001_MCHP-CDB\Library\LibraryRefs\Resistor.SchLib; ComponentLink3Description: Open Symbol; ComponentLink4URL: C:\ALTIUM_WORK\00001_MCHP-CDB\Library\Footprints\RES_C_0201.PcbLib; ComponentLink4Description: Open Footprint; ComponentLink5Description: Open Footprint 2; ComponentLink6Description: Open Footprint 3; ComponentLink7Description: Open Footprint 4; Operating Temperature: -55C to +155C; Category: Resistor; Type: RES SMD; Composition: TKF; Supplier 1: Digi-Key; Supplier Part Number 1: 541-CRCW020120K0FNEDCT-ND; Quantity Override: 1
R33 = RES2228: Manufacturer 1: Yageo; Manufacturer Part Number 1: RC0201FR-074K02L; Description_: RES TKF 4.02k 1% 1/20W SMD 0201; Dev Tools Status: Production; Power: 1/20W; Owner: Ilie Galan; Populated: YES; Temperature Coefficient: 200ppm/C; MCHP-ID: RES2228; Revision: 1; Symbol: Resistor; Status: MCL Design; ComponentLink1URL: https://chn-vm-apps.microchip.com/mchprepo/parts/Datasheets/PYu-RC_Group_51_RoHS_L_10.pdf; ComponentLink1Description: SVN Datasheet; ComponentLink2URL: C:\ALTIUM_WORK\00001_MCHP-CDB\Datasheets\PYu-RC_Group_51_RoHS_L_10.pdf; ComponentLink2Description: Local Datasheet; ComponentLink3URL: C:\ALTIUM_WORK\00001_MCHP-CDB\Library\LibraryRefs\Resistor.SchLib; ComponentLink3Description: Open Symbol; ComponentLink4URL: C:\ALTIUM_WORK\00001_MCHP-CDB\Library\Footprints\RES_C_0201.PcbLib; ComponentLink4Description: Open Footprint; ComponentLink5Description: Open Footprint 2; ComponentLink6Description: Open Footprint 3; ComponentLink7Description: Open Footprint 4; Operating Temperature: -55C to +125C; Category: Resistor; Type: RES SMD; Composition: TFK; Supplier 1: Digi-Key; Supplier Part Number 1: YAG2287CT-ND; Quantity Override: 1
R34 = RSMT1294: Manufacturer 1: Panasonic Electronic Components; Manufacturer Part Number 1: ERJ-PA2F51R0X; Description_: RES TKF 51R 1% 1/5W SMD 0402; Dev Tools Status: Design; Voltage: 50V; Temperature Coeffcient: 100ppm/C; Power: 1/5W; Owner: Dragos Danaila; Populated: YES; MCHP-ID: RSMT1294; Revision: 1; Symbol: Resistor; Status: MCL Design; ComponentLink1URL: https://chn-vm-apps.microchip.com/mchprepo/parts/Datasheets/AOA0000C331.pdf; ComponentLink1Description: SVN Datasheet; ComponentLink2URL: C:\ALTIUM_WORK\00001_MCHP-CDB\Datasheets\AOA0000C331.pdf; ComponentLink2Description: Local Datasheet; ComponentLink3URL: C:\ALTIUM_WORK\00001_MCHP-CDB\Library\LibraryRefs\Resistor.SchLib; ComponentLink3Description: Open Symbol; ComponentLink4URL: C:\ALTIUM_WORK\00001_MCHP-CDB\Library\Footprints\RES_C_0402.PcbLib; ComponentLink4Description: Open Footprint; ComponentLink5Description: Open Footprint 2; ComponentLink6Description: Open Footprint 3; ComponentLink7Description: Open Footprint 4; Operating Temperature: -55C to +155C; Category: Resistor; Type: RES SMD; Composition: TKF; Supplier 1: Digikey; Supplier Part Number 1: P124491CT-ND; Quantity Override: 1
R35 R39 = RSMT1017: Manufacturer 1: Panasonic; Manufacturer Part Number 1: ERJ-2RKF1004X; Description_: RES TKF 1M 1% 1/10W SMD 0402; Dev Tools Status: Production; Voltage: 50V; Temperature Coeffcient: 100ppm/C; Power: 1/10W; Owner: Brent Lanphear; Populated: DNP; MCHP-ID: RSMT1017; Revision: 2; Symbol: Resistor; Status: MCL Design; ComponentLink1URL: https://chn-vm-apps.microchip.com/mchprepo/parts/Datasheets/AOA0000CE2.pdf; ComponentLink1Description: SVN Datasheet; ComponentLink2URL: C:\ALTIUM_WORK\00001_MCHP-CDB\Datasheets\AOA0000CE2.pdf; ComponentLink2Description: Local Datasheet; ComponentLink3URL: C:\ALTIUM_WORK\00001_MCHP-CDB\Library\LibraryRefs\Resistor.SchLib; ComponentLink3Description: Open Symbol; ComponentLink4URL: C:\ALTIUM_WORK\00001_MCHP-CDB\Library\Footprints\RES_C_0402.PcbLib; ComponentLink4Description: Open Footprint; ComponentLink5Description: Open Footprint 2; ComponentLink6Description: Open Footprint 3; ComponentLink7Description: Open Footprint 4; Operating Temperature: -55C to +155C; Category: Resistor; Type: RES SMD; Composition: TKF; Supplier 1: Digi-Key; Supplier Part Number 1: P1.00MLCT-ND; Quantity Override: 1
TP14-TP16 = CON1759: as TP10 on sheet 02 - Power Distribution; MCHP-ID: CON1759; Revision: A; Symbol: Test Point No BOM; Status: MCL Design; ComponentLink1Description: SVN Datasheet; ComponentLink2Description: Local Datasheet; ComponentLink3URL: C:\ALTIUM_WORK\00001_MCHP-CDB\Library\LibraryRefs\Test Point No BOM.SchLib; ComponentLink3Description: Open Symbol; ComponentLink4URL: C:\ALTIUM_WORK\00001_MCHP-CDB\Library\Footprints\TP_1mm_SMD.PcbLib; ComponentLink4Description: Open Footprint; ComponentLink5Description: Open Footprint 2; ComponentLink6Description: Open Footprint 3; ComponentLink7Description: Open Footprint 4; Type: Test Point; Category: Connector; Quantity Override: 1
U4 = MIC8923: SAMA7G54 MPU 1000MHz Cortex-A7 TFBGA-343; Manufacturer Part Number 1: SAMA7G54-V/4HB; Manufacturer 1: Microchip; Description_: MCHP MPU 32-BIT Cortex-A7 1000MHz 128kB SAMA7G54-V/4HB TFBGA-343; Populated: YES; Dev Tools Status: Design; Owner: Ciprian Abramov; Package: TFBGA-343; MCHP-ID: MIC8923; Value: SAMA7G54; Symbol: SAMA7G54 TFBGA-343; Type: 32-Bit MPU; Status: MCL Design; Revision: 1; Category: MCHP-Microcontroller; ComponentLink1Description: SVN Datasheet; ComponentLink2Description: Local Datasheet; ComponentLink3URL: C:\ALTIUM_WORK\00001_MCHP-CDB\Library\LibraryRefs\SAMA7G54 TFBGA-343.SchLib; ComponentLink3Description: Open Symbol; ComponentLink4URL: C:\ALTIUM_WORK\00001_MCHP-CDB\Library\Footprints\TFBGA-343_14x14.PcbLib; ComponentLink4Description: Open Footprint; ComponentLink5Description: Open Footprint 2; ComponentLink6Description: Open Footprint 3; ComponentLink7Description: Open Footprint 4; Supplier 1: Microchip; Supplier Part Number 1: SAMA7G54-V/4HB; Quantity Override: 1
Y1 = OSC1092: Crystal; Manufacturer 1: NDK; Description_: CRYSTAL 32.768kHz 12.5pF SMD NX2012SA; Dev Tools Status: Production; Owner: Jamus Griego; Tolerance: ±20ppm; Load Capacitance: 12.5pF; Populated: YES; MCHP-ID: OSC1092; Revision: 1; Symbol: Crystal 2 Pins; Status: MCL Design; ComponentLink1URL: https://chn-vm-apps.microchip.com/mchprepo/parts/Datasheets/c_NX2012SA-STD-MUB-1_e.pdf; ComponentLink1Description: SVN Datasheet; ComponentLink2URL: C:\ALTIUM_WORK\00001_MCHP-CDB\Datasheets\c_NX2012SA-STD-MUB-1_e.pdf; ComponentLink2Description: Local Datasheet; ComponentLink3URL: C:\ALTIUM_WORK\00001_MCHP-CDB\Library\LibraryRefs\Crystal 2 Pins.SchLib; ComponentLink3Description: Open Symbol; ComponentLink4URL: C:\ALTIUM_WORK\00001_MCHP-CDB\Library\Footprints\CRYSTAL_NX2012SA.PcbLib; ComponentLink4Description: Open Footprint; ComponentLink5Description: Open Footprint 2; ComponentLink6Description: Open Footprint 3; ComponentLink7Description: Open Footprint 4; Type: Crystal; Category: Crystal/Oscillator; Supplier 1: Digi-Key; Supplier Part Number 1: 644-1219-1-ND; Quantity Override: 1
Y2 = MIC6659: Manufacturer 1: Microchip Technology; Manufacturer Part Number 1: DSC1001DI5-024.0000T; Description_: MCHP CLOCK OSCILLATOR SINGLE 24MHz DSC1001DI5-024.0000 SMD-2520; Dev Tools Status: Design; Owner: Maurizio Gavardoni; Populated: YES; MCHP-ID: MIC6659; Revision: A; Symbol: DSC10xx DFN-4; Status: MCL Design; ComponentLink1Description: SVN Datasheet; ComponentLink2Description: Local Datasheet; ComponentLink3URL: C:\ALTIUM_WORK\00001_MCHP-CDB\Library\LibraryRefs\DSC10xx DFN-4.SchLib; ComponentLink3Description: Open Symbol; ComponentLink4URL: C:\ALTIUM_WORK\00001_MCHP-CDB\Library\Footprints\DFN-4_2.5x2.PcbLib; ComponentLink4Description: Open Footprint; ComponentLink5Description: Open Footprint 2; ComponentLink6Description: Open Footprint 3; ComponentLink7Description: Open Footprint 4; Category: MCHP-Clock/Timing; Type: Oscillator; Supplier 1: Digi-Key; Supplier Part Number 1: DSC1001DI5-024.0000T-ND; Quantity Override: 1
Y3 = OSC1047: Crystal; Manufacturer 1: Abracon Corporation; Description_: CRYSTAL 24MHz 18pF SMD ABM8G; Dev Tools Status: Production; Owner: Mark Loper; Populated: DNP; MCHP-ID: OSC1047; Revision: 1; Symbol: Crystal 4 Pins; Status: MCL Design; ComponentLink1URL: https://chn-vm-apps.microchip.com/mchprepo/parts/Datasheets/ABM8G.pdf; ComponentLink1Description: SVN Datasheet; ComponentLink2URL: C:\ALTIUM_WORK\00001_MCHP-CDB\Datasheets\ABM8G.pdf; ComponentLink2Description: Local Datasheet; ComponentLink3URL: C:\ALTIUM_WORK\00001_MCHP-CDB\Library\LibraryRefs\Crystal 4 Pins.SchLib; ComponentLink3Description: Open Symbol; ComponentLink4URL: C:\ALTIUM_WORK\00001_MCHP-CDB\Library\Footprints\CRYSTAL_ABM8G.PcbLib; ComponentLink4Description: Open Footprint; ComponentLink5Description: Open Footprint 2; ComponentLink6Description: Open Footprint 3; ComponentLink7Description: Open Footprint 4; Package: ABM8G; Type: Crystal; Category: Crystal/Oscillator; Supplier 1: Digi-Key; Supplier Part Number 1: 535-10273-1-ND; Quantity Override: 1
Y4 = MIC8888: Manufacturer 1: Microchip Technology; Manufacturer Part Number 1: DSC6003MA3B-032K768; Description_: MCHP CLOCK OSCILLATOR SINGLE 32.768KHz DSC6003MA3B-032K768 SMD DFN-4; Dev Tools Status: Design; Owner: Ciprian Abramov; Populated: DNP; MCHP-ID: MIC8888; Revision: 1; Symbol: DSC60xx DFN-4_LGA-4; Status: MCL Design; ComponentLink1Description: SVN Datasheet; ComponentLink2Description: Local Datasheet; ComponentLink3URL: C:\ALTIUM_WORK\00001_MCHP-CDB\Library\LibraryRefs\DSC60xx DFN-4_LGA-4.SchLib; ComponentLink3Description: Open Symbol; ComponentLink4URL: C:\ALTIUM_WORK\00001_MCHP-CDB\Library\Footprints\DFN-4_2x1.6.PcbLib; ComponentLink4Description: Open Footprint; ComponentLink5Description: Open Footprint 2; ComponentLink6Description: Open Footprint 3; ComponentLink7Description: Open Footprint 4; Category: MCHP-Clock/Timing; Type: Oscillator; Supplier 1: Digi-Key; Supplier Part Number 1: DSC6003MA3B-032K768-ND; Quantity Override: 1; Supplier 2: Mouser; Supplier Part Number 2: 579-6003MA3B032K768